# Altium schematic sheet SCH-10-Power Connectors.SchDoc
size A
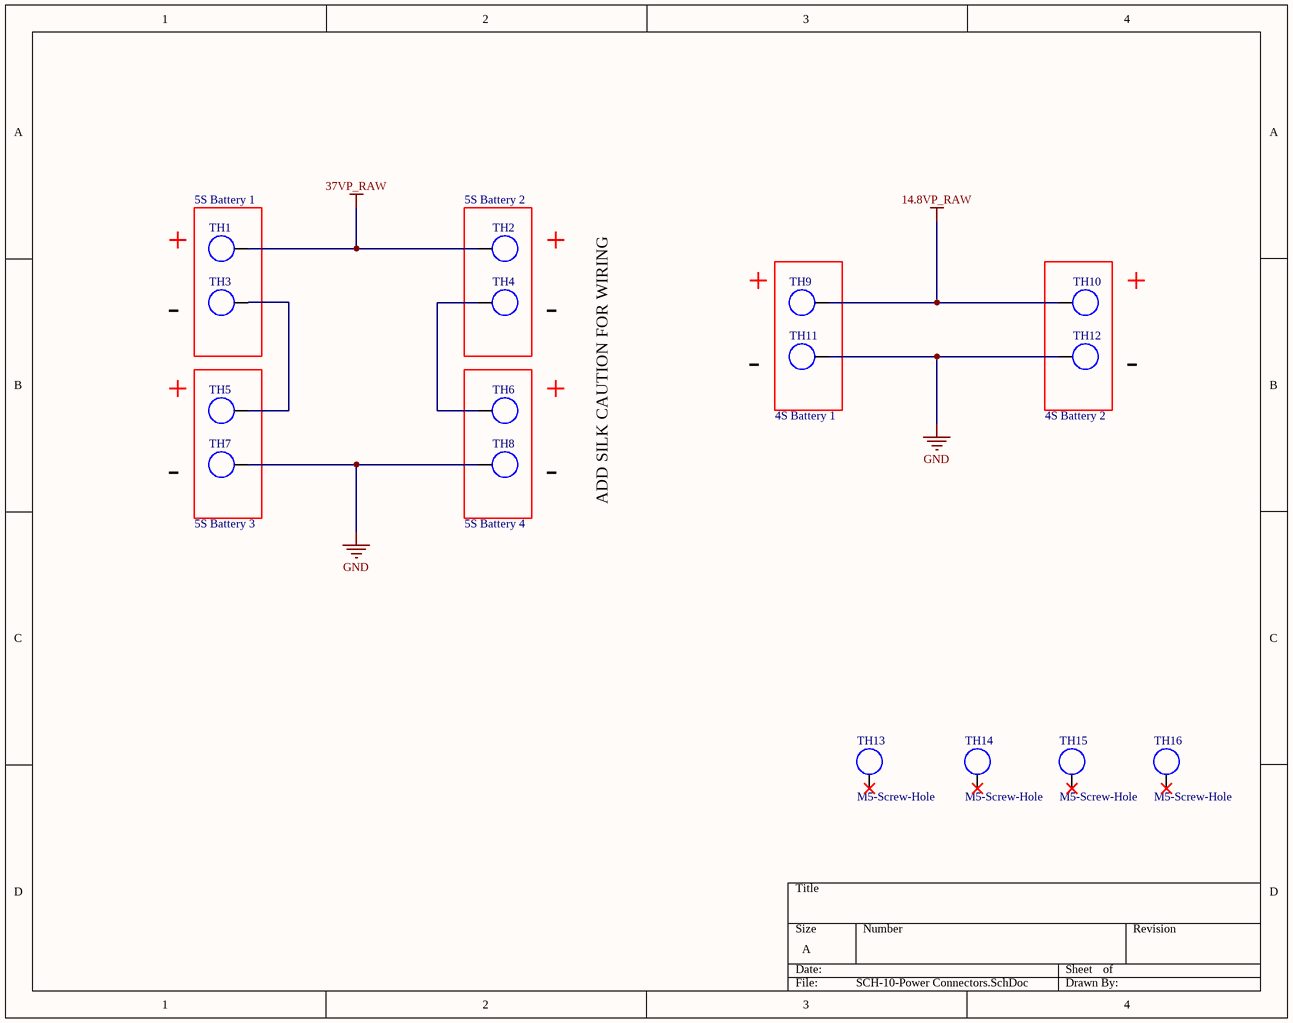
[diagram p0: SCH-10-Power Connectors.SchDoc]

## Parts
TH1  12AWG_TH  [12AWG_Wire_TH]  (value not drawn)
TH2  12AWG_TH  [12AWG_Wire_TH]  (value not drawn)
TH3  12AWG_TH  [12AWG_Wire_TH]  (value not drawn)
TH4  12AWG_TH  [12AWG_Wire_TH]  (value not drawn)
TH5  12AWG_TH  [12AWG_Wire_TH]  (value not drawn)
TH6  12AWG_TH  [12AWG_Wire_TH]  (value not drawn)
TH7  12AWG_TH  [12AWG_Wire_TH]  (value not drawn)
TH8  12AWG_TH  [12AWG_Wire_TH]  (value not drawn)
TH9  10AWG_TH  [10AWG_Wire_TH]  (value not drawn)
TH10  10AWG_TH  [10AWG_Wire_TH]  (value not drawn)
TH11  10AWG_TH  [10AWG_Wire_TH]  (value not drawn)
TH12  10AWG_TH  [10AWG_Wire_TH]  (value not drawn)
TH13  M5-Screw-Hole  [M5_Screw_Hole]
TH14  M5-Screw-Hole  [M5_Screw_Hole]
TH15  M5-Screw-Hole  [M5_Screw_Hole]
TH16  M5-Screw-Hole  [M5_Screw_Hole]

## Blocks framed on the sheet
5S Battery 1: TH1 TH3
5S Battery 2: TH2 TH4

## Nets
14.8VP_RAW: TH9.1 TH10.1
37VP_RAW: TH1.1 TH2.1
GND: TH7.1 TH8.1 TH11.1 TH12.1
NetTH3_1: TH3.1 TH5.1
NetTH4_1: TH4.1 TH6.1

Not connected (* = marked no-connect by the designer): TH13 1*; TH14 1*; TH15 1*; TH16 1*

## Notes on the sheet
- +
- -
- (near TH11) 4S Battery 1
- (near TH12) 4S Battery 2
- ADD SILK CAUTION FOR WIRING
- (near TH7) 5S Battery 3
- (near TH8) 5S Battery 4